# Altium schematic sheet OV2640.SchDoc
size A4
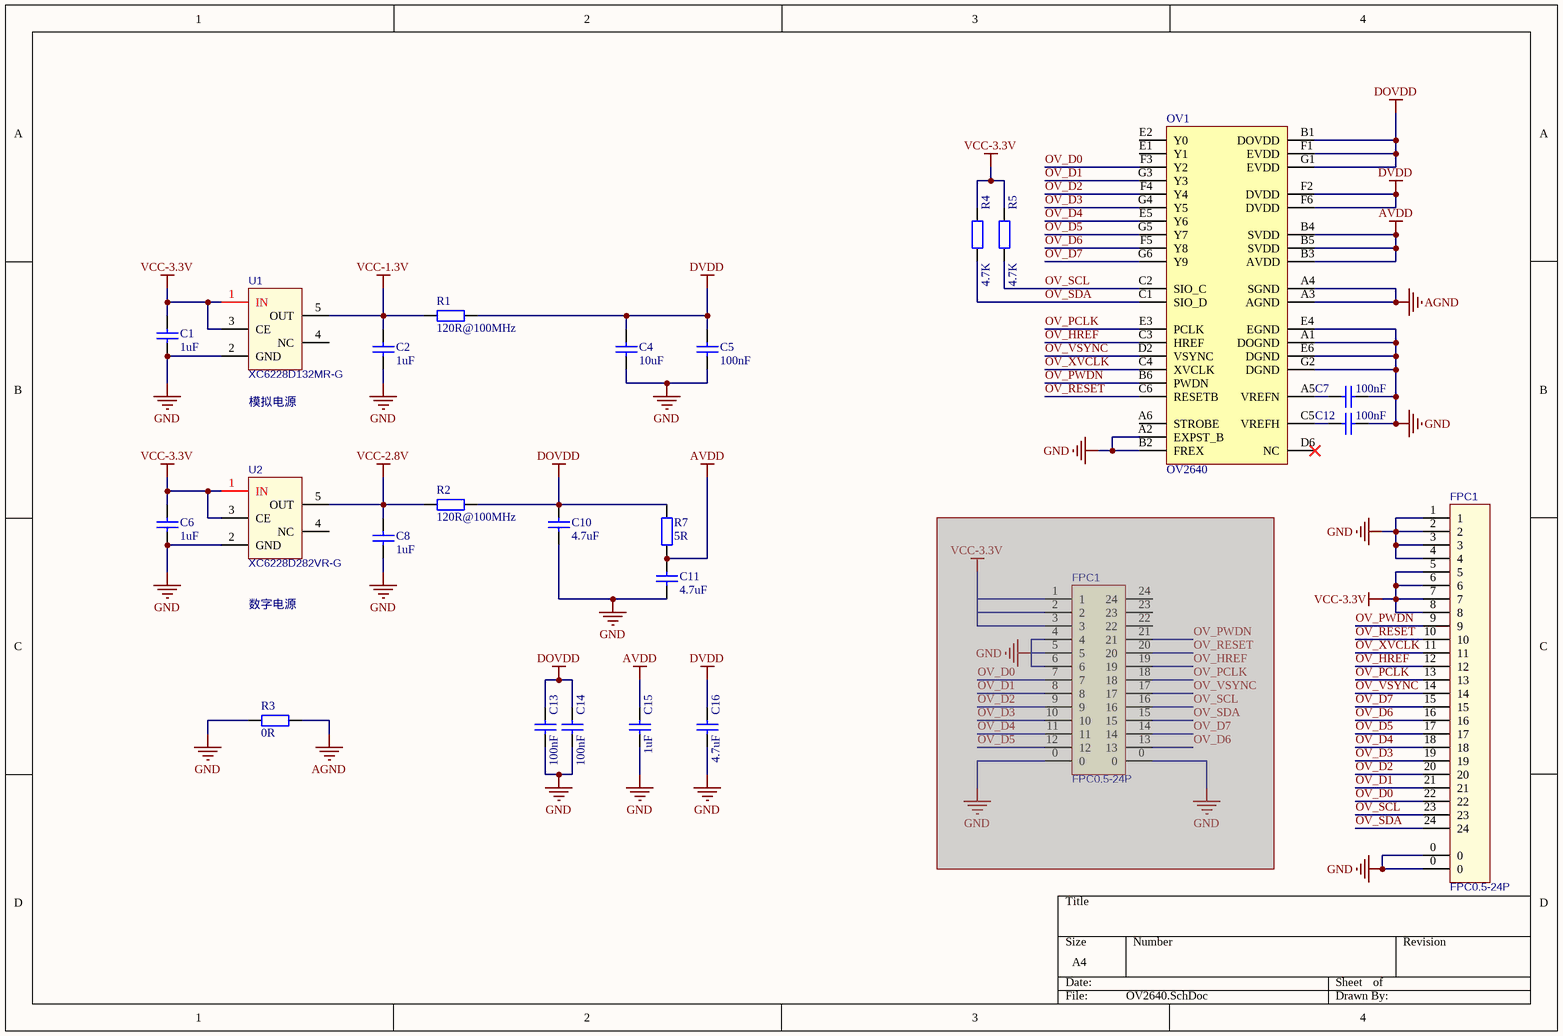
[diagram p0: OV2640.SchDoc]

## Parts
(Parts that share a designator on the sheet are numbered #1, #2 ... from top to bottom, then left to right.)
C1  1uF  [0603-C]
C2  1uF  [0603-C]
C4  10uF  [0603-C]
C5  100nF  [0603-C]
C6  1uF  [0603-C]
C7  100nF  [0603-C]
C8  1uF  [0603-C]
C10  4.7uF  [0603-C]
C11  4.7uF  [0603-C]
C12  100nF  [0603-C]
C13  100nF  [0603-C]
C14  100nF  [0603-C]
C15  1uF  [0603-C]
C16  4.7uF  [0603-C]
FPC1#1  FPC0.5-24P  [FPC-SMD_P0.50-24P_XJ-FGS]
FPC1#2  FPC0.5-24P  [FPC-SMD_P0.50-24P_XJ-FGS]  (masked out: inside a compile mask, not in the netlist)
OV1  OV2640  [摄像头IC-座子]
R1  120R@100MHz  [0603-R]
R2  120R@100MHz  [0603-R]
R3  0R  [0603-R]
R4  4.7K  [0603-R]
R5  4.7K  [0603-R]
R7  5R  [0603-R]
U1  XC6228D132MR-G  [XC6228D332VR-G]
U2  XC6228D282VR-G  [XC6228D332VR-G]

## Nets
AGND: OV1.A3(AGND) OV1.A4(SGND) R3.2
AVDD: C11.2 C15.2 OV1.B3(AVDD) OV1.B4(SVDD) OV1.B5(SVDD) R7.2
DOVDD: C10.2 C13.2 C14.2 OV1.B1(DOVDD) OV1.F1(EVDD) OV1.G1(EVDD) R2.2 R7.1
DVDD: C4.2 C5.2 C16.2 OV1.F2(DVDD) OV1.F6(DVDD) R1.2
GND: C1.1 C2.1 C4.1 C5.1 C6.1 C7.1 C8.1 C10.1 C11.1 C12.1 C13.1 C14.1 C15.1 C16.1 FPC1#1.0 FPC1#1.1 FPC1#1.2 FPC1#1.3 FPC1#1.4 OV1.A1(DOGND) OV1.A2(EXPST_B) OV1.B2(FREX) OV1.E4(EGND) OV1.E6(DGND) OV1.G2(DGND) R3.1 U1.2(GND) U2.2(GND)
VCC-1.3V: C2.2 R1.1 U1.5(OUT)
VCC-2.8V: C8.2 R2.1 U2.5(OUT)
VCC-3.3V: C1.2 C6.2 FPC1#1.5 FPC1#1.6 FPC1#1.7 FPC1#1.8 R4.2 R5.2 U1.1(IN) U1.3(CE) U2.1(IN) U2.3(CE)
OV_D0: FPC1#1.22 OV1.F3(Y2)
OV_D1: FPC1#1.21 OV1.G3(Y3)
OV_D2: FPC1#1.20 OV1.F4(Y4)
OV_D3: FPC1#1.19 OV1.G4(Y5)
OV_D4: FPC1#1.18 OV1.E5(Y6)
OV_D5: FPC1#1.17 OV1.G5(Y7)
OV_D6: FPC1#1.16 OV1.F5(Y8)
OV_D7: FPC1#1.15 OV1.G6(Y9)
OV_HREF: FPC1#1.12 OV1.C3(HREF)
OV_PCLK: FPC1#1.13 OV1.E3(PCLK)
OV_PWDN: FPC1#1.9 OV1.B6(PWDN)
OV_RESET: FPC1#1.10 OV1.C6(RESETB)
OV_SCL: FPC1#1.23 OV1.C2(SIO_C) R5.1
OV_SDA: FPC1#1.24 OV1.C1(SIO_D) R4.1
OV_VSYNC: FPC1#1.14 OV1.D2(VSYNC)
OV_XVCLK: FPC1#1.11 OV1.C4(XVCLK)
NetC7_2: C7.2 OV1.A5(VREFN)
NetC12_2: C12.2 OV1.C5(VREFH)

Not connected (* = marked no-connect by the designer): OV1 A6(STROBE) D6(NC)* E1(Y1) E2(Y0); U1 4(NC); U2 4(NC)

## Notes on the sheet
- (near U1) 模拟电源
- 数字电源

## Library data of the parts
C1 C2 C4-C8 C10-C16 = C: 贴片电容; BOM名称: 无极性贴片电容; 联系卖家，免费查找封装: 唯一出售店铺网址https://shop463601444.taobao.com
FPC1#1 FPC1#2 = FPC0.5-24P: BOM_Manufacturer: Shenzhen Cankemeng; Contributor: LCSC; BOM_Supplier: LCSC; BOM_Supplier Part: C132514; BOM_Manufacturer Part: -; BOM_JLCPCB Part Class: Extended Part; spicePre: F; spiceSymbolName: FPC0.5-24P
R1-R5 R7 = R: 贴片电阻; 联系卖家，免费查找封装: 唯一出售店铺网址https://shop463601444.taobao.com; BOM名称: 贴片电阻
U1 = XC6228D122VR-G: BOM_Manufacturer: TOREX; BOM_Supplier: LCSC; BOM_Manufacturer Part: XC6228D332VR-G; BOM_Supplier Part: C69841; BOM_JLCPCB Part Class: Extended Part; spicePre: U; spiceSymbolName: XC6228D332VR-G
U2 = XC6228D282VR-G: BOM_Manufacturer: TOREX; BOM_Supplier: LCSC; BOM_Manufacturer Part: XC6228D332VR-G; BOM_Supplier Part: C69841; BOM_JLCPCB Part Class: Extended Part; spicePre: U; spiceSymbolName: XC6228D332VR-G